# EAGLE design LED-Schematic (EAGLE 9.6.2)
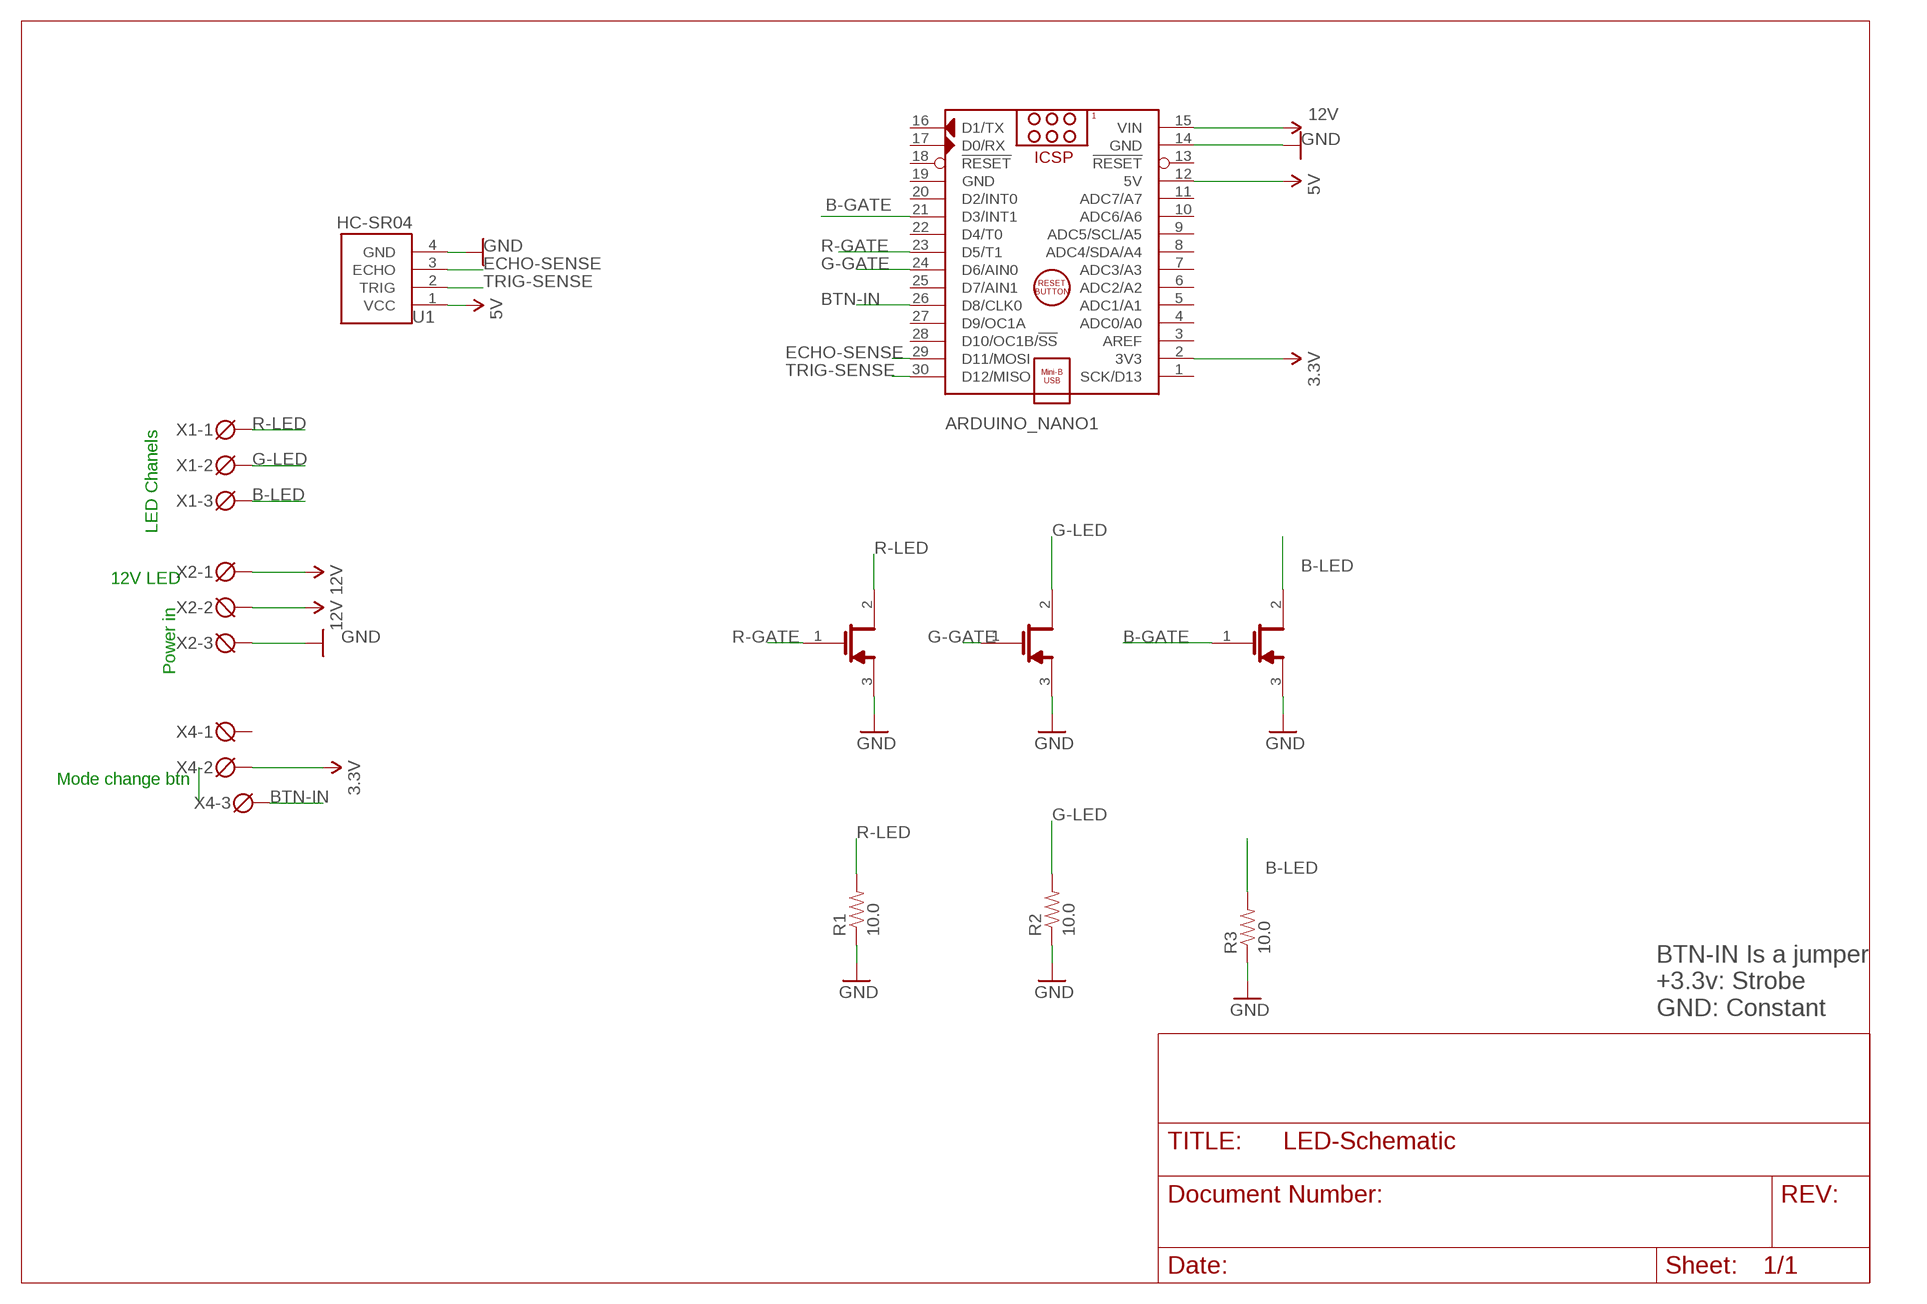
[diagram p0: schematic, sheet 1]

## Parts
ARDUINO_NANO1  ARDUINO_NANO  [ARDUINO_NANO]
Q1  INFINEON_IRLB8721PBFINFINEON_IRLB8721PBF_0_0  [INFINEON_IRLB8721PBF_0]
Q2  INFINEON_IRLB8721PBFINFINEON_IRLB8721PBF_0_0  [INFINEON_IRLB8721PBF_0]
Q3  INFINEON_IRLB8721PBFINFINEON_IRLB8721PBF_0_0  [INFINEON_IRLB8721PBF_0]
R1  10.0  10OHM-1/4W-1%(PTH)  [AXIAL-0.3]
R2  10.0  10OHM-1/4W-1%(PTH)  [AXIAL-0.3]
R3  10.0  10OHM-1/4W-1%(PTH)  [AXIAL-0.3]
U1  HC-SR04  [XCVR_HC-SR04]
X1  DG3XX-03-3.5  [DG350-3.5-03P]
X2  DG3XX-03-3.5  [DG350-3.5-03P]
X4  DG3XX-03-3.5  [DG350-3.5-03P]

## Nets
3.3V: ARDUINO_NANO1.2(3V3) X4.2
5V: ARDUINO_NANO1.12(5V) U1.1(VCC)
12V: ARDUINO_NANO1.15(VIN) X2.1 X2.2
B-GATE: ARDUINO_NANO1.21(D3/INT1) Q3.1(G)
B-LED: Q3.2(D) R3.P$2 X1.3
BTN-IN: ARDUINO_NANO1.26(D8/CLK0) X4.3
ECHO-SENSE: ARDUINO_NANO1.29(D11/MOSI) U1.3(ECHO)
G-GATE: ARDUINO_NANO1.24(D6/AIN0) Q2.1(G)
G-LED: Q2.2(D) R2.P$2 X1.2
GND: ARDUINO_NANO1.14(GND) Q1.3(S) Q2.3(S) Q3.3(S) R1.P$1 R2.P$1 R3.P$1 U1.4(GND) X2.3
R-GATE: ARDUINO_NANO1.23(D5/T1) Q1.1(G)
R-LED: Q1.2(D) R1.P$2 X1.1
TRIG-SENSE: ARDUINO_NANO1.30(D12/MISO) U1.2(TRIG)
Unconnected: ARDUINO_NANO1.1(SCK/D13) ARDUINO_NANO1.3(AREF) ARDUINO_NANO1.4(ADC0/A0) ARDUINO_NANO1.5(ADC1/A1) ARDUINO_NANO1.6(ADC2/A2) ARDUINO_NANO1.7(ADC3/A3) ARDUINO_NANO1.8(ADC4/SDA/A4) ARDUINO_NANO1.9(ADC5/SCL/A5) ARDUINO_NANO1.10(ADC6/A6) ARDUINO_NANO1.11(ADC7/A7) ARDUINO_NANO1.13(!RESET) ARDUINO_NANO1.16(D1/TX) ARDUINO_NANO1.17(D0/RX) ARDUINO_NANO1.18(!RESET) ARDUINO_NANO1.20(D2/INT0) ARDUINO_NANO1.22(D4/T0) ARDUINO_NANO1.25(D7/AIN1) ARDUINO_NANO1.27(D9/OC1A) ARDUINO_NANO1.28(D10/OC1B/!SS) X4.1

## Notes on the sheet
- LED Chanels
- 12V LED
- Power in
- Mode change btn
- BTN-IN Is a jumper
  +3.3v: Strobe
  GND: Constant

## Power pins joined to a net without a drawn wire
GND: ARDUINO_NANO1.19(GND)

## Library data of the parts
ARDUINO_NANO1 = ArduinoNanoV30:ARDUINO_NANO: Arduino Nano V3.0 Module Overview: The Arduino Nano is a small, complete, and breadboard-friendly board based on the ATmega328 (Arduino Nano 3.x) or ATmega168 (Arduino Nano 2.x). It has more or less the same functionality of the Arduino Duemilanove, but in a different package. It lacks only a DC power jack, and works with a Mini-B USB cable instead of a standard one. The Nano was designed and is being produced by Gravitech <http://www.gravitech.us/arna30wiatp.html>. General specifications: Item Value Microcontroller Atmel ATmega168 or ATmega328 Operating Voltage (logic level) 5 V Input Voltage (recommended) 7-12 V Input Voltage (limits) 6-20 V Digital I/O Pins 14 (of which 6 provide PWM output) Analog Input Pins 8 DC Current per I/O Pin 40 mA Flash Memory 16 KB (ATmega168) or 32 KB (ATmega328) of which 2 KB used by bootloader SRAM 1 KB (ATmega168) or 2 KB (ATmega328) EEPROM 512 bytes (ATmega168) or 1 KB (ATmega328) Clock Speed 16 MHz Dimensions (Inches) 0.73" x 1.70" Dimensions (mm) 18mm x 45mm Overall height About 9 mm (not including pins) Weigth 5 g Power: The Arduino Nano can be powered via the Mini-B USB connection, 6-20V unregulated external power supply (pin 30), or 5V regulated external power supply (pin 27). The power source is automatically selected to the highest voltage source. Memory: The ATmega168 has 16 KB of flash memory for storing code (of which 2 KB is used for the bootloader); the ATmega328 has 32 KB, (also with 2 KB used for the bootloader). The ATmega168 has 1 KB of SRAM and 512 bytes of EEPROM (which can be read and written with the EEPROM library); the ATmega328 has 2 KB of SRAM and 1 KB of EEPROM. Input and Output: Each of the 14 digital pins on the Nano can be used as an input or output, using pinMode(), digitalWrite(), and digitalRead() functions. They operate at 5 volts. Each pin can provide or receive a maximum of 40 mA and has an internal pull-up resistor (disconnected by default) of 20-50 kOhms. In addition, some pins have specialized functions. Visit Arduino - ArduinoBoardNano <https://www.arduino.cc/en/Main/ArduinoBoardNano>
Q1-Q3 = Infineon - IRLB8721PbF:INFINEON_IRLB8721PBF: High Frequency Synchronous Buck Converter; CENTROID_NOT_SPECIFIED: No; DATASHEET: https://upverter.com/datasheet/6023de1dc29e00ae136963535d37ebb95ee78d8c.pdf; DIGIKEY_DESCRIPTION: TRANS MOSFET N-CH 30V 62A TO-220AB; DIGIKEY_PART_NUMBER: IRLB8721PBF-ND; IMPORTED_FROM: octopart; IPC_LAND_PATTERN_NAME: TO-220; LEAD_FREE: yes; MF: Infineon; MOUNTING_TYPE: through hole; MOUSER_PART_NUMBER: 942-IRLB8721PBF; MPN: IRLB8721PbF; NUM_PINS: 3; PACKAGE: TO220AB-3; PREFIX: Q; ROHS: yes; SYMBOL_0_0: N-Channel Enhanced MOSFET; TEMPERATURE_RANGE_HIGH: +175°C; TEMPERATURE_RANGE_LOW: -55°C; TYPE: transistor
R1-R3 = SparkFun-Resistors:10OHM-1/4W-1%(PTH): RES-12180; PROD_ID: RES-12180
U1 = HC-SR04:HC-SR04: Ultrasonic Sensor Module Check availability <https://pricing.snapeda.com/parts/HC-SR04/SparkFun%20Electronics/view-part?ref=eda>; AVAILABILITY: Not in stock; DESCRIPTION: HC-SR04 Ultrasonic Sensor Qwiic Platform Evaluation Expansion Board; MF: SparkFun Electronics; MP: HC-SR04; PACKAGE: None; PRICE: None
X1 X2 X4 = degson:DG3XX-03: DG350-3.5-03P DG306-5.0-03P

## Board
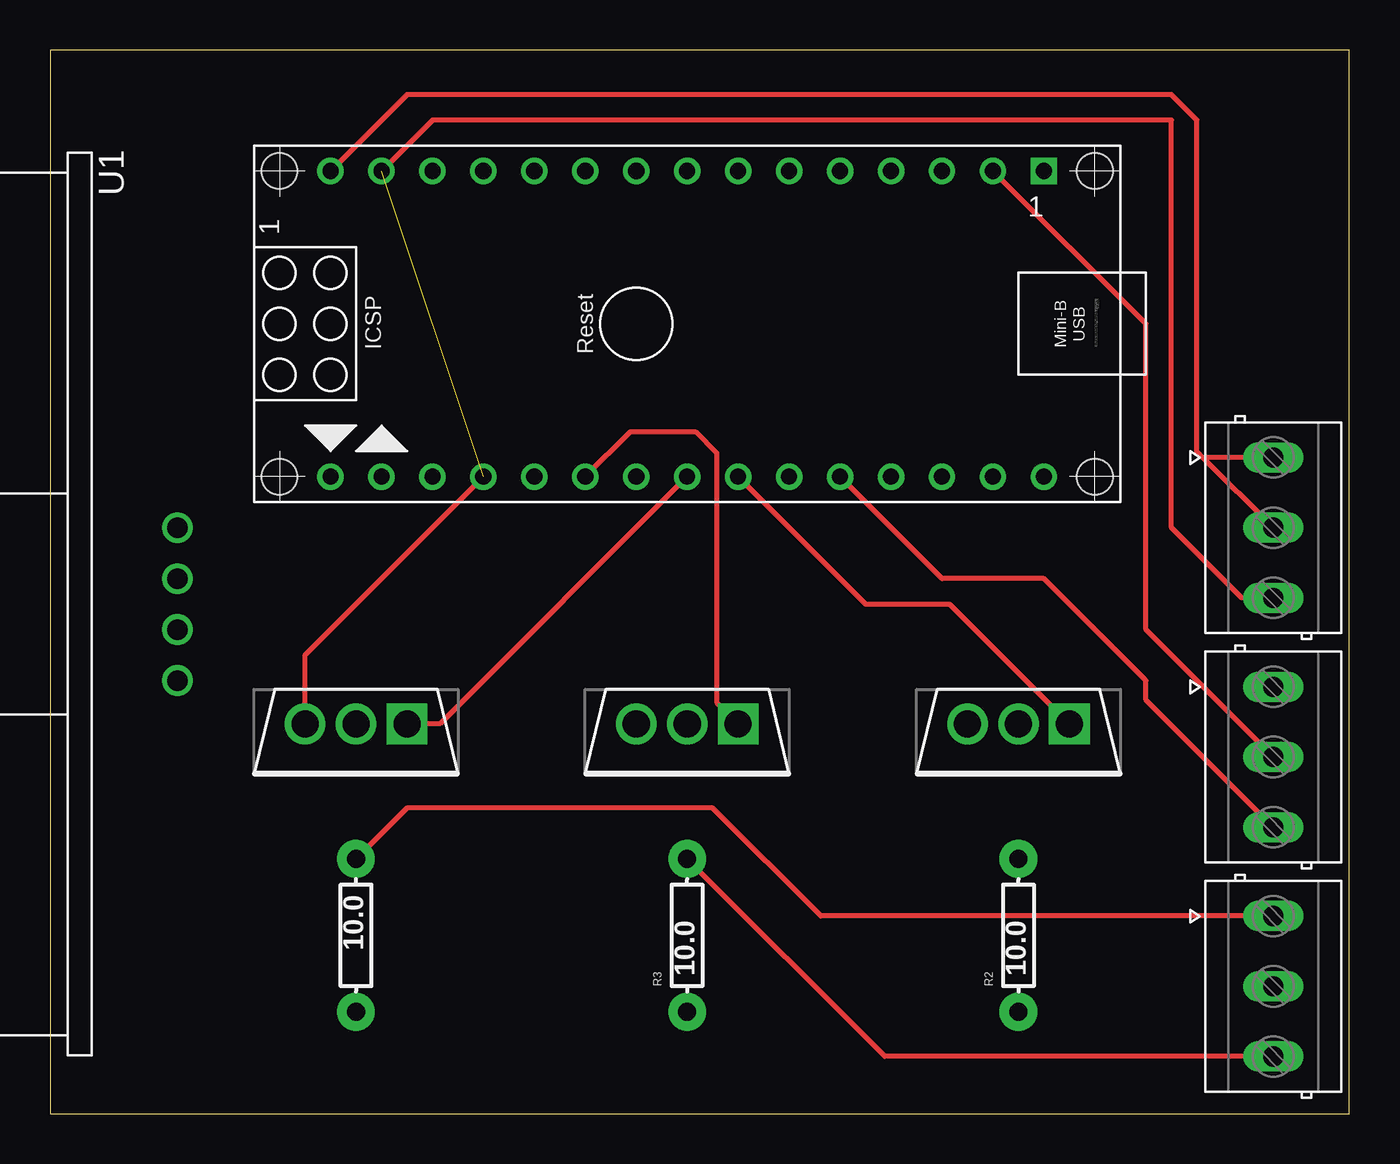
[diagram p1: board, top side]
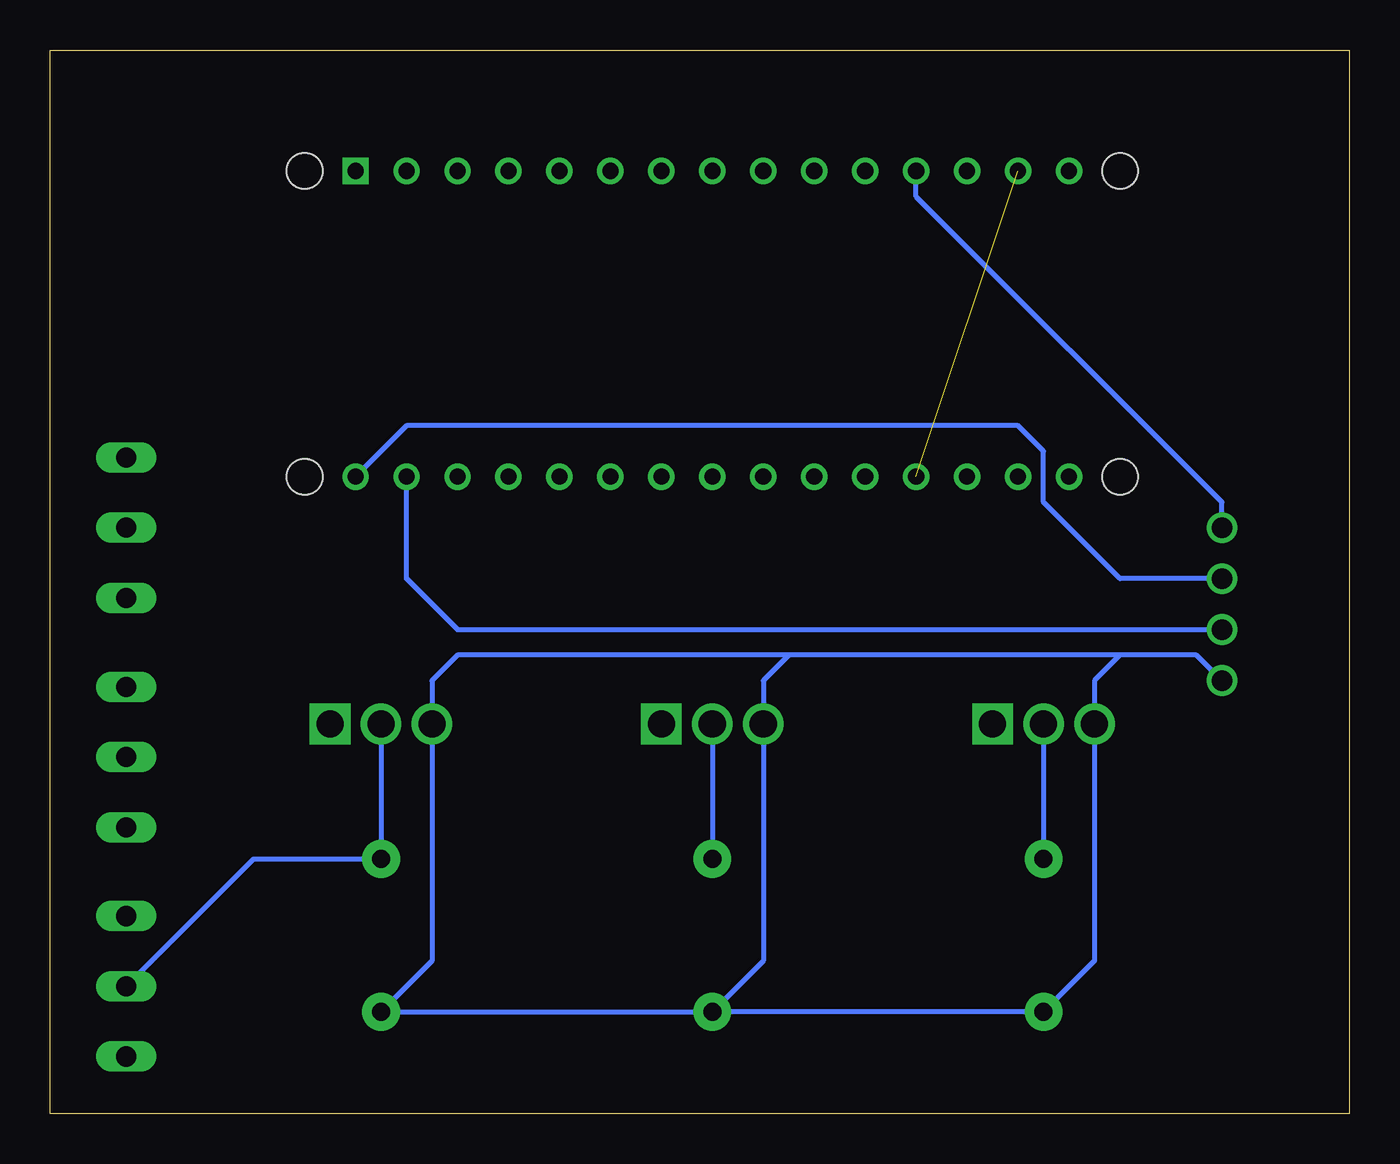
[diagram p2: board, bottom side, seen from below]

Size 64.75 x 53.01 mm. Coordinates in mm from the lower left corner, seen from the top.
Outline: 0,0 64.75,0 64.75,53.01 0,53.01 0,0
Copper layers (1*16): Top 0.035mm / dielectric 1.5mm / Bottom 0.035mm
Design rules "pcbway": minimum track width 6mil, minimum drill 0.3mm, track to track 0.205mm, track to pad 0.205mm, pad to pad 0.205mm, via to via 0.205mm, smd to smd 8mil, copper to edge 40mil, drill to drill 8mil, minimum pad ring 10mil, minimum via ring 8mil, stop-mask expansion 4mil, vias tented up to drill 25mil, thermal gap 10mil

### Footprints (pad centres in the part's own frame; a part is rotated, then mirrored left to right if it is on the bottom)
ARDUINO_NANO = drill 0.8 square: 1 -20.32,-7.62 | drill 0.8: 2 -17.78,-7.62; 3 -15.24,-7.62; 4 -12.7,-7.62; 5 -10.16,-7.62; 6 -7.62,-7.62; 7 -5.08,-7.62; 8 -2.54,-7.62; 9 0,-7.62; 10 2.54,-7.62; 11 5.08,-7.62; 12 7.62,-7.62; 13 10.16,-7.62; 14 12.7,-7.62; 15 15.24,-7.62; 16 15.24,7.62; 17 12.7,7.62; 18 10.16,7.62; 19 7.62,7.62; 20 5.08,7.62; 21 2.54,7.62; 22 0,7.62; 23 -2.54,7.62; 24 -5.08,7.62; 25 -7.62,7.62; 26 -10.16,7.62; 27 -12.7,7.62; 28 -15.24,7.62; 29 -17.78,7.62; 30 -20.32,7.62 | hole 1.778: -22.86,-7.62; -22.86,7.62; 17.78,7.62; 17.78,-7.62
INFINEON_IRLB8721PBF_0 = drill 1.35 pad 0.305 square: 1 -0.378,2.54 | drill 1.35 pad 0.305: 2 -0.378,0; 3 -0.378,-2.54
AXIAL-0.3 = drill 0.9 pad 1.88: P$1 -3.81,0; P$2 3.81,0
XCVR_HC-SR04 = drill 1.02: 1 -3.81,0; 2 -1.27,0; 3 1.27,0; 4 3.81,0
DG350-3.5-03P = drill 1 long: 1 -3.5,0; 2 0,0; 3 3.5,0

### Placement (x,y rotation side)
ARDUINO_NANO1  29.21,39.37 180 top
Q1  15.24,19.05 270 top
Q2  48.26,19.05 270 top
Q3  31.75,19.05 270 top
R1  15.24,8.89 90 top
R2  48.26,8.89 90 top
R3  31.75,8.89 90 top
U1  6.35,25.4 270 top
X1  60.96,6.35 270 top
X2  60.96,29.21 270 top
X4  60.96,17.78 270 top

### Tracks (layer width: path | path; a pad name or v marks a point on that pad's centre or on a via)
3.3V
  Top 0.254: X4.2 54.61,24.13 54.61,39.37 ARDUINO_NANO1.2
5V
  Bottom 0.254: U1.1 6.35,30.48 21.59,45.72 ARDUINO_NANO1.12
12V
  Top 0.254: X2.2 57.46,32.71 | ARDUINO_NANO1.15 17.78,50.8 55.88,50.8 57.15,49.53 57.15,33.02 57.46,32.71 | X2.1 57.46,32.71
B-GATE
  Top 0.254: ARDUINO_NANO1.21 28.91,33.99 32.15,33.99 33.22,32.93 33.22,20.5 Q3.1
B-LED
  Top 0.254: X1.3 41.6,2.85 R3.P$2
  Bottom 0.254: Q3.2 R3.P$2
BTN-IN
  Top 0.254: X4.3 54.61,20.63 54.61,21.59 49.53,26.67 44.45,26.67 ARDUINO_NANO1.26
ECHO-SENSE
  Bottom 0.254: ARDUINO_NANO1.29 46.99,26.67 44.45,24.13 U1.3
G-GATE
  Top 0.254: ARDUINO_NANO1.24 40.64,25.4 44.83,25.4 Q2.1
G-LED
  Bottom 0.254: Q2.2 R2.P$2 54.61,12.7 X1.2
GND  (1 unrouted)
  Top 0.254: X2.3 59.38,25.71 55.88,29.21 55.88,49.53 19.05,49.53 ARDUINO_NANO1.14 | Q1.3 12.7,22.86 ARDUINO_NANO1.19
  Bottom 0.254: R3.P$1 29.21,7.62 Q3.3 29.21,21.59 27.94,22.86 | R3.P$1 R2.P$1 45.72,7.62 Q2.3 45.72,21.59 44.45,22.86 27.94,22.86 | R3.P$1 R1.P$1 12.7,7.62 Q1.3 12.7,21.59 11.43,22.86 | X2.3 60.65,25.4 | U1.4 7.62,22.86 11.43,22.86 | 11.43,22.86 27.94,22.86
R-GATE
  Top 0.254: ARDUINO_NANO1.23 19.43,19.43 Q1.1
R-LED
  Top 0.254: X1.1 38.41,9.85 33.02,15.24 17.78,15.24 R1.P$2
  Bottom 0.254: Q1.2 R1.P$2
TRIG-SENSE
  Bottom 0.254: U1.2 11.43,26.67 15.24,30.48 15.24,33.02 16.51,34.29 46.99,34.29 ARDUINO_NANO1.30